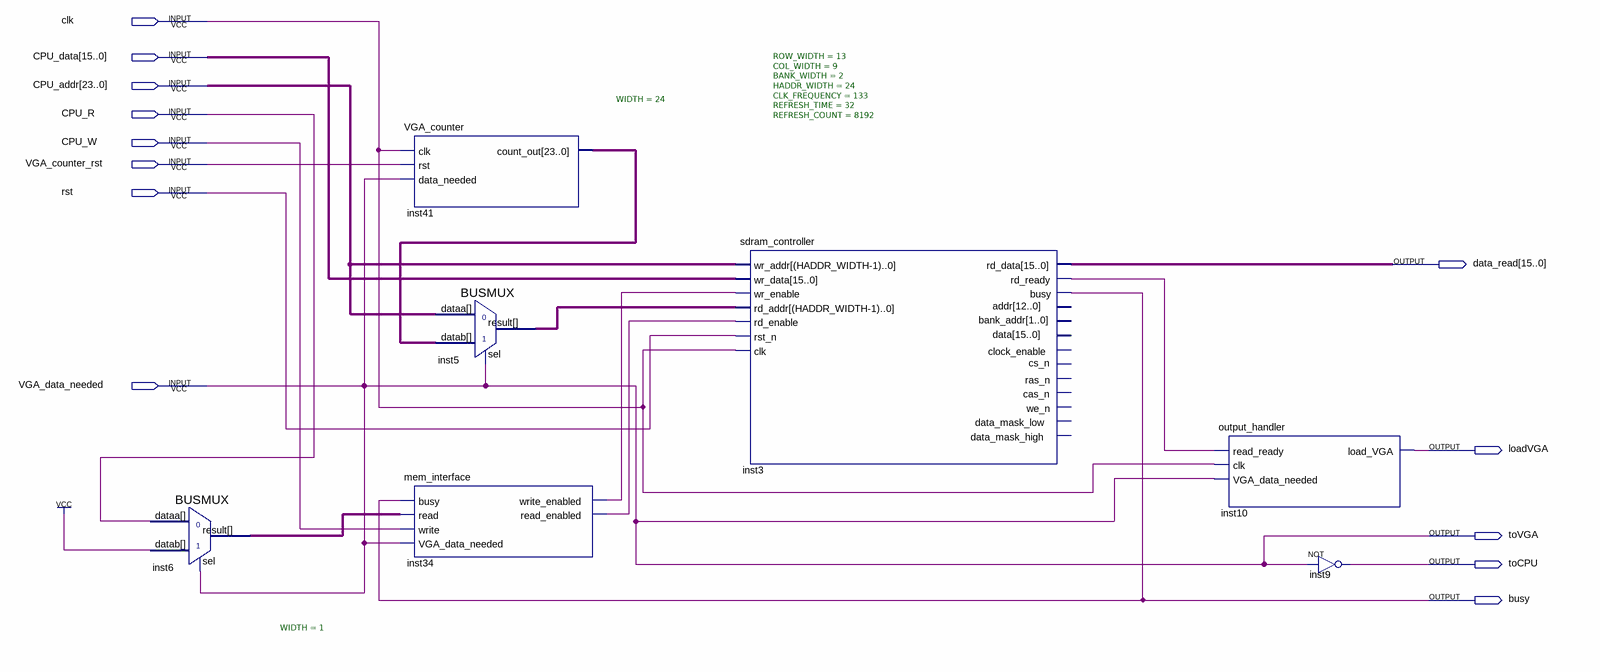
[diagram p0: schematic sheet]
// Quartus schematic North_Bridge.bdf as structural Verilog: 7 symbols, 13 pins
module North_Bridge (
  input  clk,
  input  [15:0] CPU_data,
  input  [23:0] CPU_addr,
  input  CPU_R,
  input  CPU_W,
  input  VGA_counter_rst,
  input  rst,
  input  VGA_data_needed,
  output [15:0] data_read,
  output loadVGA,
  output toVGA,
  output toCPU,
  output busy
);

  wire inst3_rd_ready, inst6_result, inst34_read_enabled, inst34_write_enabled;
  wire [23:0] inst5_result, inst41_count_out;

  BUSMUX #(.WIDTH(1)) inst6 (.datab(1'b1), .sel(VGA_data_needed), .dataa(CPU_R), .result(inst6_result));
  VGA_counter inst41 (.clk(clk), .rst(VGA_counter_rst), .data_needed(VGA_data_needed), .count_out(inst41_count_out));
  mem_interface inst34 (
    .busy(busy), .read(inst6_result), .write(CPU_W), .VGA_data_needed(VGA_data_needed),
    .write_enabled(inst34_write_enabled), .read_enabled(inst34_read_enabled));
  BUSMUX #(.WIDTH(24)) inst5 (.datab(inst41_count_out), .sel(VGA_data_needed), .dataa(CPU_addr), .result(inst5_result));
  sdram_controller #(.ROW_WIDTH(13), .COL_WIDTH(9), .BANK_WIDTH(2), .HADDR_WIDTH(24), .CLK_FREQUENCY(133), .REFRESH_TIME(32), .REFRESH_COUNT(8192)) inst3 (
    .wr_addr(CPU_addr), .wr_data(CPU_data), .wr_enable(inst34_write_enabled), .rd_addr(inst5_result),
    .rd_enable(inst34_read_enabled), .rst_n(rst), .clk(clk), .rd_data(data_read), .rd_ready(inst3_rd_ready),
    .busy(busy));  // open: clock_enable, cs_n, ras_n, cas_n, we_n, data_mask_low, data_mask_high, addr, bank_addr, data
  output_handler inst10 (.read_ready(inst3_rd_ready), .clk(clk), .VGA_data_needed(VGA_data_needed), .load_VGA(loadVGA));
  not inst9 (toCPU, VGA_data_needed);

  assign toVGA = VGA_data_needed;
endmodule
